# EAGLE schematic V14 (EAGLE 7.1.0)
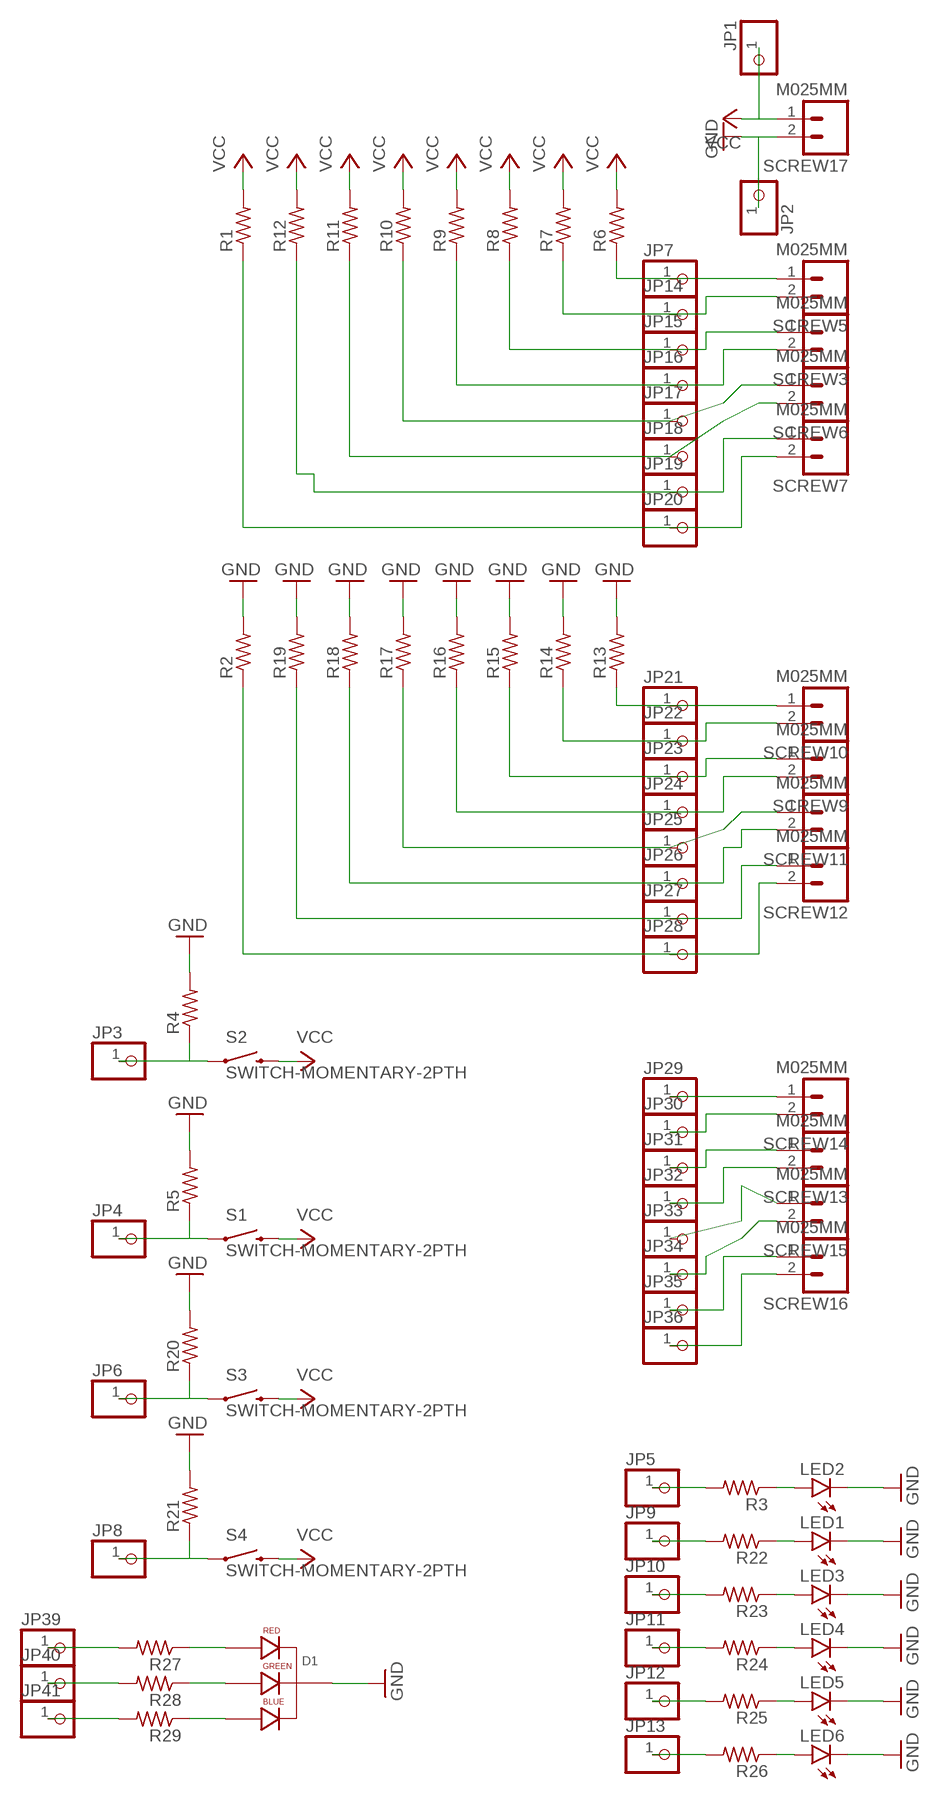
[diagram p0: schematic, sheet 1]

## Parts
D1  LED-RGB-CC-THRUCLEAR  [LED-RGB-THRU]
JP1  PINHD-1X1  [1X01]
JP2  PINHD-1X1  [1X01]
JP3  PINHD-1X1  [1X01]
JP4  PINHD-1X1  [1X01]
JP5  PINHD-1X1  [1X01]
JP6  PINHD-1X1  [1X01]
JP7  PINHD-1X1  [1X01]
JP8  PINHD-1X1  [1X01]
JP9  PINHD-1X1  [1X01]
JP10  PINHD-1X1  [1X01]
JP11  PINHD-1X1  [1X01]
JP12  PINHD-1X1  [1X01]
JP13  PINHD-1X1  [1X01]
JP14  PINHD-1X1  [1X01]
JP15  PINHD-1X1  [1X01]
JP16  PINHD-1X1  [1X01]
JP17  PINHD-1X1  [1X01]
JP18  PINHD-1X1  [1X01]
JP19  PINHD-1X1  [1X01]
JP20  PINHD-1X1  [1X01]
JP21  PINHD-1X1  [1X01]
JP22  PINHD-1X1  [1X01]
JP23  PINHD-1X1  [1X01]
JP24  PINHD-1X1  [1X01]
JP25  PINHD-1X1  [1X01]
JP26  PINHD-1X1  [1X01]
JP27  PINHD-1X1  [1X01]
JP28  PINHD-1X1  [1X01]
JP29  PINHD-1X1  [1X01]
JP30  PINHD-1X1  [1X01]
JP31  PINHD-1X1  [1X01]
JP32  PINHD-1X1  [1X01]
JP33  PINHD-1X1  [1X01]
JP34  PINHD-1X1  [1X01]
JP35  PINHD-1X1  [1X01]
JP36  PINHD-1X1  [1X01]
JP39  PINHD-1X1  [1X01]
JP40  PINHD-1X1  [1X01]
JP41  PINHD-1X1  [1X01]
LED1  LED-3MM-NO_SILK  [LED3MM-NS]
LED2  LED-3MM-NO_SILK  [LED3MM-NS]
LED3  LED-3MM-NO_SILK  [LED3MM-NS]
LED4  LED-3MM-NO_SILK  [LED3MM-NS]
LED5  LED-3MM-NO_SILK  [LED3MM-NS]
LED6  LED-3MM-NO_SILK  [LED3MM-NS]
R1  R-US_0207/9  [0207/9]
R2  R-US_0207/9  [0207/9]
R3  R-US_0207/9  [0207/9]
R4  R-US_0207/9  [0207/9]
R5  R-US_0207/9  [0207/9]
R6  R-US_0207/9  [0207/9]
R7  R-US_0207/9  [0207/9]
R8  R-US_0207/9  [0207/9]
R9  R-US_0207/9  [0207/9]
R10  R-US_0207/9  [0207/9]
R11  R-US_0207/9  [0207/9]
R12  R-US_0207/9  [0207/9]
R13  R-US_0207/9  [0207/9]
R14  R-US_0207/9  [0207/9]
R15  R-US_0207/9  [0207/9]
R16  R-US_0207/9  [0207/9]
R17  R-US_0207/9  [0207/9]
R18  R-US_0207/9  [0207/9]
R19  R-US_0207/9  [0207/9]
R20  R-US_0207/9  [0207/9]
R21  R-US_0207/9  [0207/9]
R22  R-US_0207/9  [0207/9]
R23  R-US_0207/9  [0207/9]
R24  R-US_0207/9  [0207/9]
R25  R-US_0207/9  [0207/9]
R26  R-US_0207/9  [0207/9]
R27  R-US_0207/9  [0207/9]
R28  R-US_0207/9  [0207/9]
R29  R-US_0207/9  [0207/9]
S1  SWITCH-MOMENTARY-2PTH  [TACTILE-PTH]
S2  SWITCH-MOMENTARY-2PTH  [TACTILE-PTH]
S3  SWITCH-MOMENTARY-2PTH  [TACTILE-PTH]
S4  SWITCH-MOMENTARY-2PTH  [TACTILE-PTH]
SCREW3  M025MM  [SCREWTERMINAL-5MM-2]
SCREW5  M025MM  [SCREWTERMINAL-5MM-2]
SCREW6  M025MM  [SCREWTERMINAL-5MM-2]
SCREW7  M025MM  [SCREWTERMINAL-5MM-2]
SCREW9  M025MM  [SCREWTERMINAL-5MM-2]
SCREW10  M025MM  [SCREWTERMINAL-5MM-2]
SCREW11  M025MM  [SCREWTERMINAL-5MM-2]
SCREW12  M025MM  [SCREWTERMINAL-5MM-2]
SCREW13  M025MM  [SCREWTERMINAL-5MM-2]
SCREW14  M025MM  [SCREWTERMINAL-5MM-2]
SCREW15  M025MM  [SCREWTERMINAL-5MM-2]
SCREW16  M025MM  [SCREWTERMINAL-5MM-2]
SCREW17  M025MM  [SCREWTERMINAL-5MM-2]

## Nets
GND: D1.2(CATHODE) JP2.1 LED1.K(C) LED2.K(C) LED3.K(C) LED4.K(C) LED5.K(C) LED6.K(C) R2.2 R4.2 R5.2 R13.2 R14.2 R15.2 R16.2 R17.2 R18.2 R19.2 R20.2 R21.2 SCREW17.2
N$1: JP3.1 R4.1 S2.1
N$2: JP29.1 SCREW14.1
N$3: JP20.1 R1.1 SCREW7.2
N$4: LED2.A R3.1
N$5: JP5.1 R3.2
N$6: JP4.1 R5.1 S1.1
N$7: JP17.1 R10.1 SCREW6.1
N$8: JP18.1 R11.1 SCREW6.2
N$9: JP19.1 R12.1 SCREW7.1
N$10: JP7.1 R6.1 SCREW5.1
N$11: JP14.1 R7.1 SCREW5.2
N$12: JP15.1 R8.1 SCREW3.1
N$13: JP16.1 R9.1 SCREW3.2
N$14: JP21.1 R13.1 SCREW10.1
N$15: JP22.1 R14.1 SCREW10.2
N$16: JP23.1 R15.1 SCREW9.1
N$17: JP24.1 R16.1 SCREW9.2
N$18: JP25.1 R17.1 SCREW11.1
N$19: JP6.1 R20.1 S3.1
N$20: JP27.1 R19.1 SCREW12.1
N$21: JP34.1 SCREW15.2
N$22: JP35.1 SCREW16.1
N$23: JP36.1 SCREW16.2
N$24: JP26.1 R18.1 SCREW11.2
N$25: JP28.1 R2.1 SCREW12.2
N$26: JP8.1 R21.1 S4.1
N$27: LED1.A R22.1
N$28: JP9.1 R22.2
N$29: JP30.1 SCREW14.2
N$30: JP31.1 SCREW13.1
N$31: JP32.1 SCREW13.2
N$32: JP33.1 SCREW15.1
N$33: LED3.A R23.1
N$34: JP10.1 R23.2
N$35: LED4.A R24.1
N$36: JP11.1 R24.2
N$37: LED5.A R25.1
N$38: JP12.1 R25.2
N$39: LED6.A R26.1
N$40: JP13.1 R26.2
N$41: D1.1(RED_CATHODE) R27.1
N$42: JP39.1 R27.2
N$43: D1.3(GREEN_CATHODE) R28.1
N$44: JP40.1 R28.2
N$45: D1.4(BLUE_CATHODE) R29.1
N$46: JP41.1 R29.2
VCC: JP1.1 R1.2 R6.2 R7.2 R8.2 R9.2 R10.2 R11.2 R12.2 S1.3 S2.3 S3.3 S4.3 SCREW17.1

## Library data of the parts
D1 = SparkFun-LED:LED-RGB-CC-THRU: RGB Through-hole common cathode LED SparkFun Storefront: COM-00105 (Clear) COM-09264 (Diffuse); PROD_ID: DIO-08418
JP1-JP36 JP39-JP41 = adafruit:PINHD-1X1: Pin header 1x1 for 0.1" spacing With round pins
LED1-LED6 = SparkFun-LED:LED: LEDs Standard schematic elements and footprints for 5mm, 3mm, 1206, and 0603 sized LEDs. 5mm - Spark Fun Electronics SKU : COM-00529 (and others)
R1-R29 = adafruit:R-US_: RESISTOR, American symbol
S1-S4 = SparkFun-Electromechanical:SWITCH-MOMENTARY-2: Various NO switches- pushbuttons, reed, etc
SCREW3 SCREW5-SCREW7 SCREW9-SCREW17 = SparkFun-Connectors:M02: Standard 2-pin 0.1" header. Use with - straight break away headers ( PRT-00116) - right angle break away headers (PRT-00553) - swiss pins (PRT-00743) - machine pins (PRT-00117) - female headers (PRT-00115) Molex polarized connector foot print use with: PRT-08233 with associated crimp pins and housings. 2.54_SCREWTERM for use with PRT-10571. 3.5mm Screw Terminal footprints for PRT-08084 5mm Screw Terminal footprints for use with PRT-08432; STOREFRONT_ID: PRT-08432

## Net classes
0 default: width 0.254 mm, drill 0.508 mm, clearance 0.305 mm